# EAGLE design Trinket_Charger_Shield_F_052016 (EAGLE 7.5.0)
AUTHOR: BENJAMIN SHOCKLEY; REVISION: A
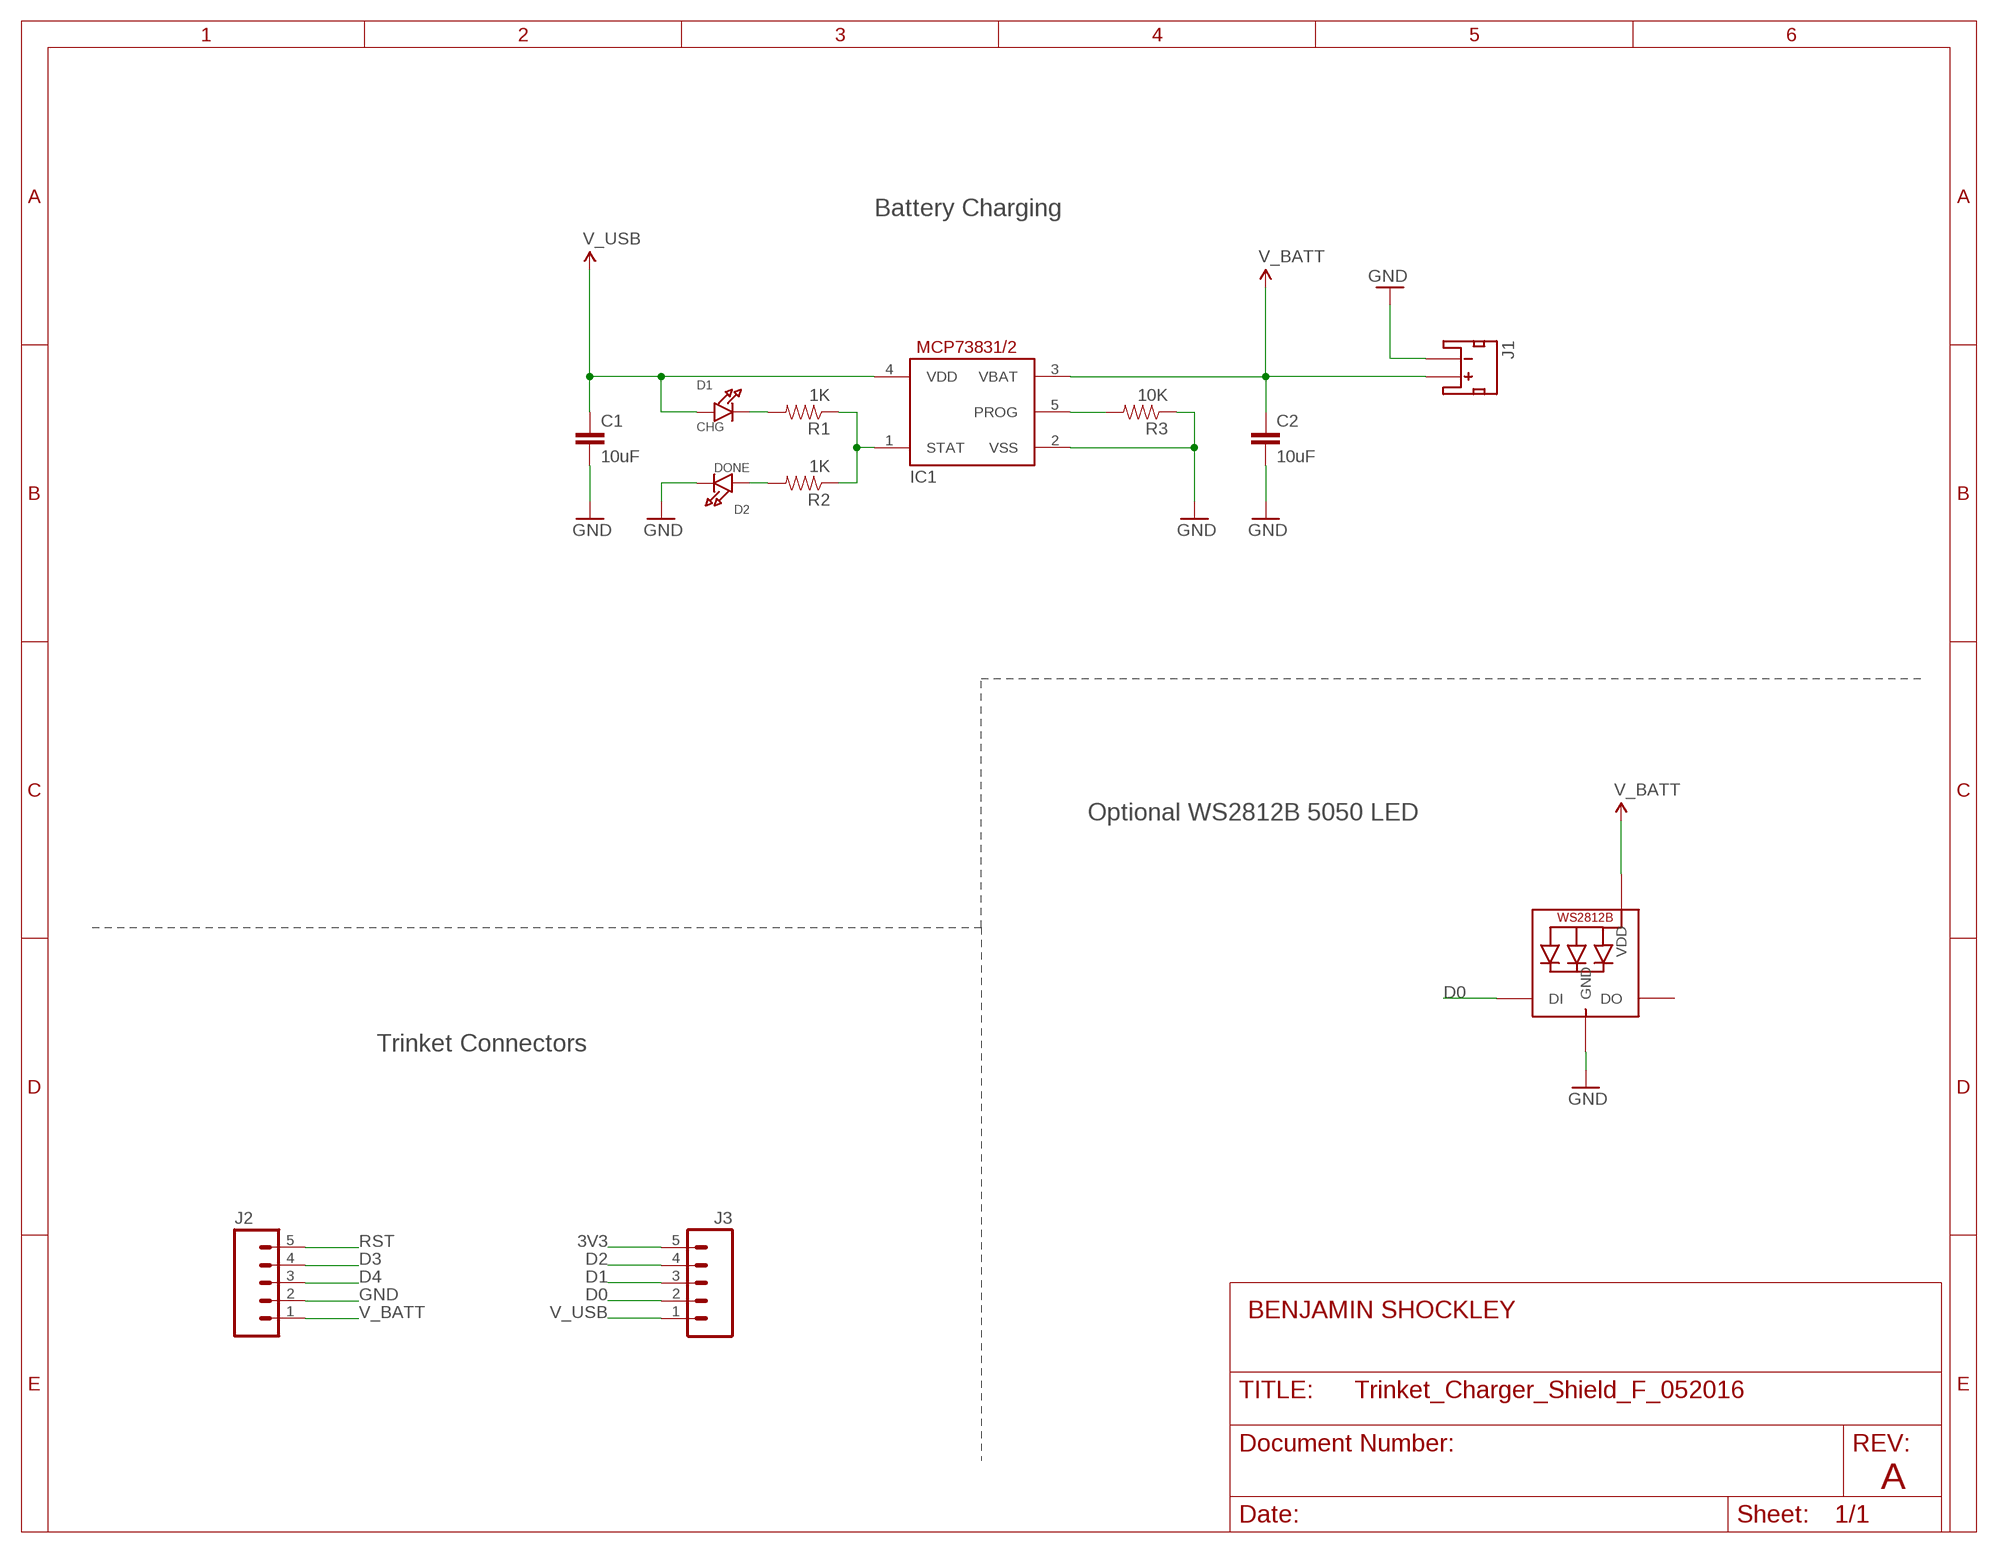
[diagram p0: schematic, sheet 1]

## Parts
C1  10uF  CAP0805  [0805]
C2  10uF  CAP0805  [0805]
D1  CHG  LED0805_NOOUTLINE  [CHIPLED_0805_NOOUTLINE]
D2  DONE  LED0805_NOOUTLINE  [CHIPLED_0805_NOOUTLINE]
IC1  MCP73831/OT  [SOT23-5L]
J1  JST_2MM_MALE  [JST-2-SMD]
J2  M05NO_SILK  [1X05_NO_SILK]
J3  M05NO_SILK  [1X05_NO_SILK]
LED  WS2812B5050  [WS2812B]
R1  1K  RESISTOR0805-RES  [0805]
R2  1K  RESISTOR0805-RES  [0805]
R3  10K  RESISTOR0805-RES  [0805]

## Nets
3V3: J3.5
D0: J3.2 LED.4-DIN(DI)
D1: J3.3
D2: J3.4
D3: J2.4
D4: J2.3
GND: C1.2 C2.2 D2.C IC1.2(VSS) J1.1(-) J2.2 LED.3-GND(GND) R3.1
N$3: IC1.5(PROG) R3.2
N$6: IC1.1(STAT) R1.1 R2.1
N$7: D1.C R1.2
N$8: D2.A R2.2
RST: J2.5
V_BATT: C2.1 IC1.3(VBAT) J1.2(+) J2.1 LED.1-VDD(VDD)
V_USB: C1.1 D1.A IC1.4(VDD) J3.1
Unconnected: J1.NC1(PAD1) J1.NC2(PAD2) LED.2-DOUT(DO)

## Notes on the sheet
- Battery Charging
- Optional WS2812B 5050 LED
- Trinket Connectors

## Library data of the parts
C1 C2 = SparkFun-Passives:CAP: Capacitor Standard 0603 ceramic capacitor, and 0.1" leaded capacitor.
D1 D2 = microbuilder:LED: LED 0603 - 0603 Surface Mount Package 2mA: Green LED - Low Power (3.9mcd, 2ma, 1.7Vf) - Digikey: 475-2709-2-ND Orange LED - Low Power (9.8mcd, 2ma, 1.8Vf) - Digikey: 475-1194-2-ND Red LED - Low Power (5mcd, 2ma, 1.8Vf) - Digikey: 475-1195-2-ND Yellow LED - Low Power (7mcd, 2ma, 1.8Vf) - Digikey: 475-1196-2-ND 5mA: Blue LED - Low Power (17mcd, 5ma, 2.9Vf) - Digikey: LNJ937W8CRACT-ND 0805 - 0805 Surface Mount Package 2mA: Red LED (8.8mcd, 2mA, 1.8Vf, Clear) - Low Power [Digikey: 475-2510-1-ND] Green LED (5mcd, 2mA, 1.8Vf, Clear) - Low Power [Digikey: 475-2730-1-ND] Yellow LED (11.3mcd, 2mA, 1.8Vf, Clear) - Low Power [Digikey: 475-2555-1-ND] 20mA: Red LED (104mcd, 20mA, Diffused) - LS R976 [Digikey: 475-1278-6-ND] Red LED (12mcd, 20mA, 2.0Vf, Clear) - APT2012EC [Digikey: 754-1128-1-ND] Green LED (15mcd, 20mA, 2.2Vf, Clear) - APT2012GC [Digikey: 754-1131-1-ND] Orange LED (160mcd, 20mA, 2.1Vf, Clear) - APT2012SECK [Digikey: 754-1130-1-ND] 1206 - 1206 Surface Mount Package Green LED (26mcd, 20mA, Diffused) - LG N971 [Digikey: 475-1407-6-ND] Red LED (15mcd, 20mA, Diffused) - LH N974 [Digikey: 475-1416-6-ND]
IC1 = adafruit:MCP73831: MCP73831/2 Miniature Single-Cell, Fully Integrated Li-Ion, Li-Polymer Charge Management Controllers. Nice and small simple lipoly charge controller, with adjustable current and status output (LED) http://www.ladyada.net/library/pcb/eaglelibrary.html
J1 = SparkFun-Connectors:JST_2MM_MALE: Mates to single-cell LiPo batteries. CONN-11443 Now with smashable polarity marks!; BTM_NEG: -; BTM_POS: +; PROD_ID: CONN-11443; TOP_NEG: -; TOP_POS: +
J2 J3 = SparkFun-Connectors:M05: Header 5 Standard 5-pin 0.1" header. Use with straight break away headers (SKU : PRT-00116), right angle break away headers (PRT-00553), swiss pins (PRT-00743), machine pins (PRT-00117), and female headers (PRT-00115). Molex polarized connector foot print use with SKU : PRT-08230 with associated crimp pins and housings.
LED = adafruit:WS2812B
R1-R3 = SparkFun-Passives:RESISTOR: Resistor Basic schematic elements and footprints for 0603, 1206, and PTH resistors.

## Board
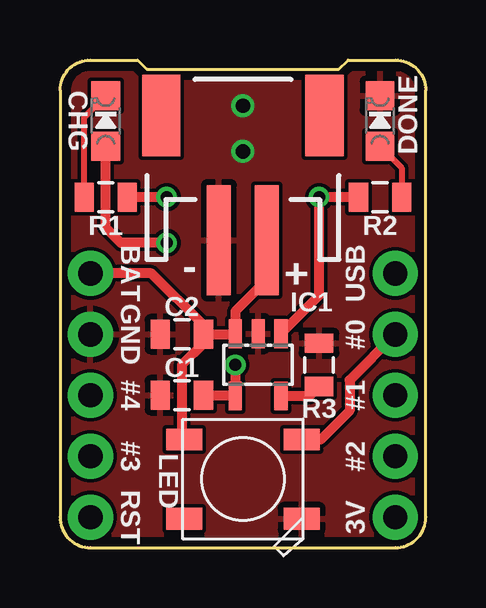
[diagram p1: board, top side]
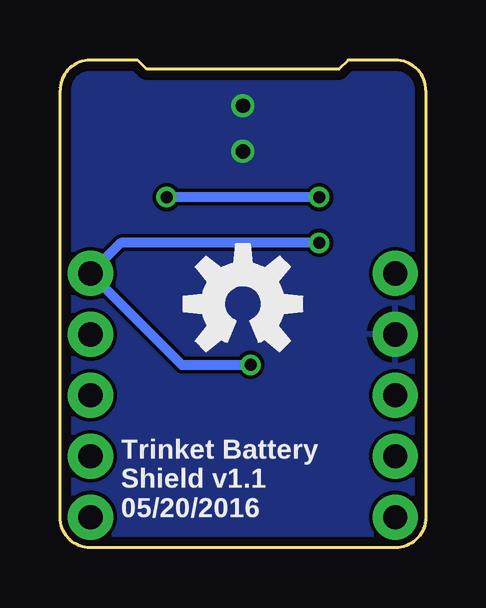
[diagram p2: board, bottom side, seen from below]

Size 15.24 x 20.32 mm. Coordinates in mm from the lower left corner, seen from the top.
Outline: 1.27,0 13.97,0 arc90 15.24,1.27 15.24,19.05 arc90 13.97,20.32 12,20.32 11.62,19.94 3.62,19.94 3.24,20.32 1.27,20.32 arc90 0,19.05 0,1.27 arc90 1.27,0
Copper layers (1*16): Top 0.0356mm / dielectric 1.5011mm / Bottom 0.0356mm
Design rules "oshpark-2layer": minimum track width 6mil, minimum drill 13mil, track to track 6mil, track to pad 6mil, pad to pad 6mil, via to via 6mil, smd to smd 6mil, copper to edge 15mil, drill to drill 6mil, minimum pad ring 7mil, minimum via ring 7mil, stop-mask expansion 2.5mil, vias tented up to drill 0mil, thermal gap 10mil

### Footprints (pad centres in the part's own frame; a part is rotated, then mirrored left to right if it is on the bottom)
0805 = smd 0.8 x 1.2: 1 -0.9,0; 2 0.9,0
CHIPLED_0805_NOOUTLINE = smd 1.2 x 1.2: A 0,-1.05; C 0,1.05
SOT23-5L = smd 0.55 x 1.2: 1 -0.95,-1.3; 2 0,-1.3; 3 0.95,-1.3; 4 0.95,1.3; 5 -0.95,1.3
JST-2-SMD = smd 1 x 4.6: 1 -1,-3.7; 2 1,-3.7 | smd 1.6 x 3.4: NC1 -3.4,1.5; NC2 3.4,1.5
1X05_NO_SILK = drill 1.016 pad 1.88: 1 0,0; 2 2.54,0; 3 5.08,0; 4 7.62,0; 5 10.16,0
WS2812B = smd 1.5 x 0.9: 1-VDD 2.45,-1.65; 2-DOUT 2.45,1.65; 3-GND -2.45,1.65; 4-DIN -2.45,-1.65

### Placement (x,y rotation side)
C1  5.08,6.35 180 top
C2  5.08,8.89 180 top
D1  1.91,17.78 0 top
D2  13.34,17.78 0 top
IC1  8.26,7.62 180 top
J1  7.62,16.51 0 top
J2  1.27,11.43 270 top
J3  13.97,11.43 270 top
LED  7.62,2.86 180 top
R1  1.91,14.61 180 top
R2  13.34,14.61 0 top
R3  10.79,7.62 270 top
U$1  [OSHW-LOGO-M]  7.62,10.16 0 bottom

### Tracks (layer width: path | path; a pad name or v marks a point on that pad's centre or on a via)
D0
  Top 0.406: J3.2 12.06,6.99 12.06,5.71 10.86,4.51 LED.4-DIN
GND  (via drill 0.6)
  other vias: 7.62,16.51 7.62,18.41
  pour Top: 0,20.32 15.24,20.32 15.24,0 0,0
  pour Bottom: 0,0 15.24,0 15.24,20.32 0,20.32
N$3
  Top 0.406: R3.2 10.39,6.32 IC1.5
N$6  (via drill 0.5)
  Top 0.406: v4.45,14.61 R1.1 | R2.1 v10.79,14.61 10.79,10.51 IC1.1
  Bottom 0.406: v4.45,14.61 v10.79,14.61
N$7
  Top 0.254: R1.2 1,17.93 D1.C
N$8
  Top 0.254: D2.A 14.23,15.83 R2.2
V_BATT
  Top 0.254: 7.28,8.89 IC1.3 | C2.1 5.98,9.26
  Top 0.406: J1.2 8.62,11.16 7.3,9.85 IC1.3 | 7.28,8.89 C2.1 5.98,8.52 5.08,7.62 5.08,4.6 LED.1-VDD | 5.98,9.26 3.81,11.43 J2.1
V_USB  (via drill 0.5)
  Top 0.406: v7.3,7.62 7.3,6.67 IC1.4 arc90 7.28,6.35 C1.1 | v4.45,12.7 2.54,12.7 1.91,13.34 D1.A
  Bottom 0.406: v7.3,7.62 10.16,7.62 J3.1 12.7,12.7 v4.45,12.7

### Text on the board
tPlace: - | +
bPlace: Trinket Battery / Shield v1.1 / 05/20/2016
tNames: BAT | USB | GND | #0 | #4 | #1 | #3 | #2 | RST | 3V